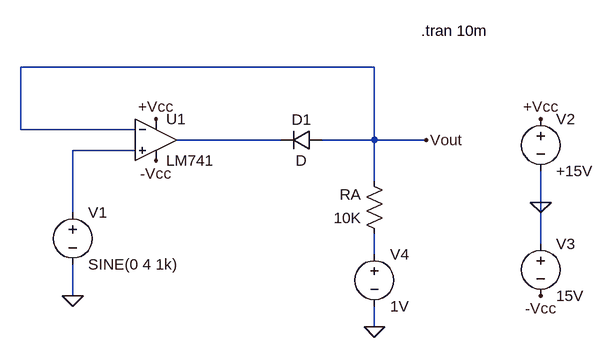
[diagram p0: schematic Positive Clipper.asc]
Positive Clipper.asc, the LTspice schematic file:
Version 4
SHEET 1 1012 680
WIRE 512 48 -32 48
WIRE -32 144 -32 48
WIRE 144 144 -32 144
WIRE 368 160 208 160
WIRE 512 160 512 48
WIRE 512 160 432 160
WIRE 592 160 512 160
WIRE 144 176 48 176
WIRE 512 224 512 160
WIRE 768 256 768 208
WIRE 48 272 48 176
WIRE 768 320 768 256
WIRE 512 336 512 304
WIRE 48 400 48 352
WIRE 512 448 512 416
FLAG 48 400 0
FLAG 768 256 0
FLAG 592 160 Vout
FLAG 176 128 +Vcc
FLAG 768 128 +Vcc
FLAG 176 192 -Vcc
FLAG 768 400 -Vcc
FLAG 512 448 0
SYMBOL Opamps\\LM741 176 96 R0
SYMATTR InstName U1
SYMBOL res 528 320 R180
WINDOW 0 36 76 Left 2
WINDOW 3 36 40 Left 2
SYMATTR InstName RA
SYMATTR Value 10K
SYMBOL voltage 48 256 R0
SYMATTR InstName V1
SYMATTR Value SINE(0 4 1k)
SYMBOL voltage 768 112 R0
SYMATTR InstName V2
SYMATTR Value +15V
SYMBOL voltage 768 304 R0
SYMATTR InstName V3
SYMATTR Value 15V
SYMBOL voltage 512 320 R0
SYMATTR InstName V4
SYMATTR Value 1V
SYMBOL diode 432 144 R90
WINDOW 0 0 32 VBottom 2
WINDOW 3 32 32 VTop 2
SYMATTR InstName D1
TEXT 584 -8 Left 2 !.tran 10m

The netlist it stands for:
* Positive Clipper.asc
XU1 N002 Vout +Vcc -Vcc N001 LM741  ; pins In+ In- V+ V- OUT
RA N003 Vout 10K
V1 N002 0 SINE(0 4 1k)
V2 +Vcc 0 +15V
V3 0 -Vcc 15V
V4 N003 0 1V
D1 Vout N001 D
.model D D
.lib standard.dio
.tran 10m
.lib LM741.lib
.backanno
.end